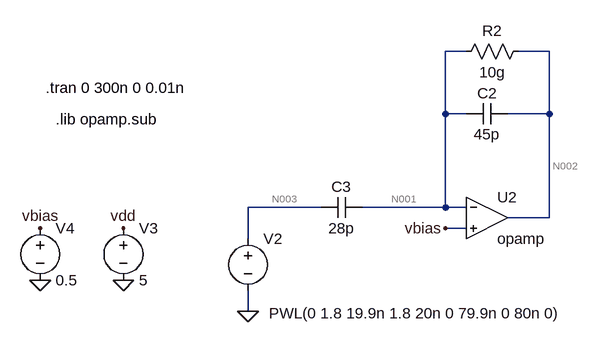
[diagram p0: schematic injecciondecarga.asc]
injecciondecarga.asc, the LTspice schematic file:
Version 4
SHEET 1 964 680
WIRE -448 -48 -480 -48
WIRE -320 -48 -368 -48
WIRE -480 48 -480 -48
WIRE -448 48 -480 48
WIRE -320 48 -320 -48
WIRE -320 48 -384 48
WIRE -672 192 -784 192
WIRE -480 192 -480 48
WIRE -480 192 -608 192
WIRE -448 192 -480 192
WIRE -320 208 -320 48
WIRE -320 208 -384 208
WIRE -448 224 -480 224
WIRE -784 240 -784 192
WIRE -784 352 -784 320
FLAG -784 352 0
FLAG -976 304 0
FLAG -976 224 vdd
FLAG -1104 304 0
FLAG -1104 224 vbias
FLAG -480 224 vbias
SYMBOL cap -384 32 R90
WINDOW 0 0 32 VBottom 2
WINDOW 3 32 32 VTop 2
SYMATTR InstName C2
SYMATTR Value 45p
SYMBOL cap -608 176 R90
WINDOW 0 0 32 VBottom 2
WINDOW 3 32 32 VTop 2
SYMATTR InstName C3
SYMATTR Value 28p
SYMBOL voltage -784 224 R0
WINDOW 123 0 0 Left 2
WINDOW 39 0 0 Left 2
WINDOW 3 32 131 Left 2
SYMATTR Value PWL(0 1.8 19.9n 1.8 20n 0 79.9n 0 80n 0)
SYMATTR InstName V2
SYMBOL voltage -976 208 R0
WINDOW 123 0 0 Left 2
WINDOW 39 0 0 Left 2
SYMATTR InstName V3
SYMATTR Value 5
SYMBOL res -352 -64 R90
WINDOW 0 0 56 VBottom 2
WINDOW 3 32 56 VTop 2
SYMATTR InstName R2
SYMATTR Value 10g
SYMBOL voltage -1104 208 R0
WINDOW 123 0 0 Left 2
WINDOW 39 0 0 Left 2
SYMATTR InstName V4
SYMATTR Value 0.5
SYMBOL Opamps\\opamp -416 144 R0
SYMATTR InstName U2
TEXT -1096 8 Left 2 !.tran 0 300n 0 0.01n
TEXT -1080 56 Left 2 !.lib opamp.sub

The netlist it stands for:
* injecciondecarga.asc
C2 N002 N001 45p
C3 N001 N003 28p
V2 N003 0 PWL(0 1.8 19.9n 1.8 20n 0 79.9n 0 80n 0)
V3 vdd 0 5
R2 N002 N001 10g
V4 vbias 0 0.5
XU2 N001 vbias N002 opamp Aol=100K GBW=10Meg  ; pins invin noninvin out
.tran 0 300n 0 0.01n
.lib opamp.sub
.backanno
.end

* Results of the author's LTspice run, read from the files saved beside the schematic
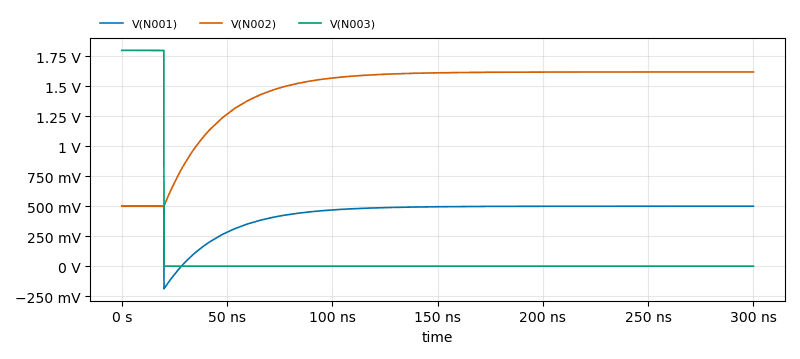
[diagram p1: Transient Analysis of injecciondecarga.asc, plotted from the saved traces]
* Transient Analysis, 1 run:
*   V(N001): min -189.1 mV, max 500 mV, average 440.5 mV, rms 459.4 mV, last 500 mV
*   V(N002): min 500 mV, max 1.62 V, average 1.449 V, rms 1.486 V, last 1.62 V
*   V(N003): min 0 V, max 1.8 V, average 119.7 mV, rms 464 mV, last 0 V